# Altium schematic sheet SPI_Breakout.SchDoc
size A4; SheetNumber: 5; SheetTotal: 11
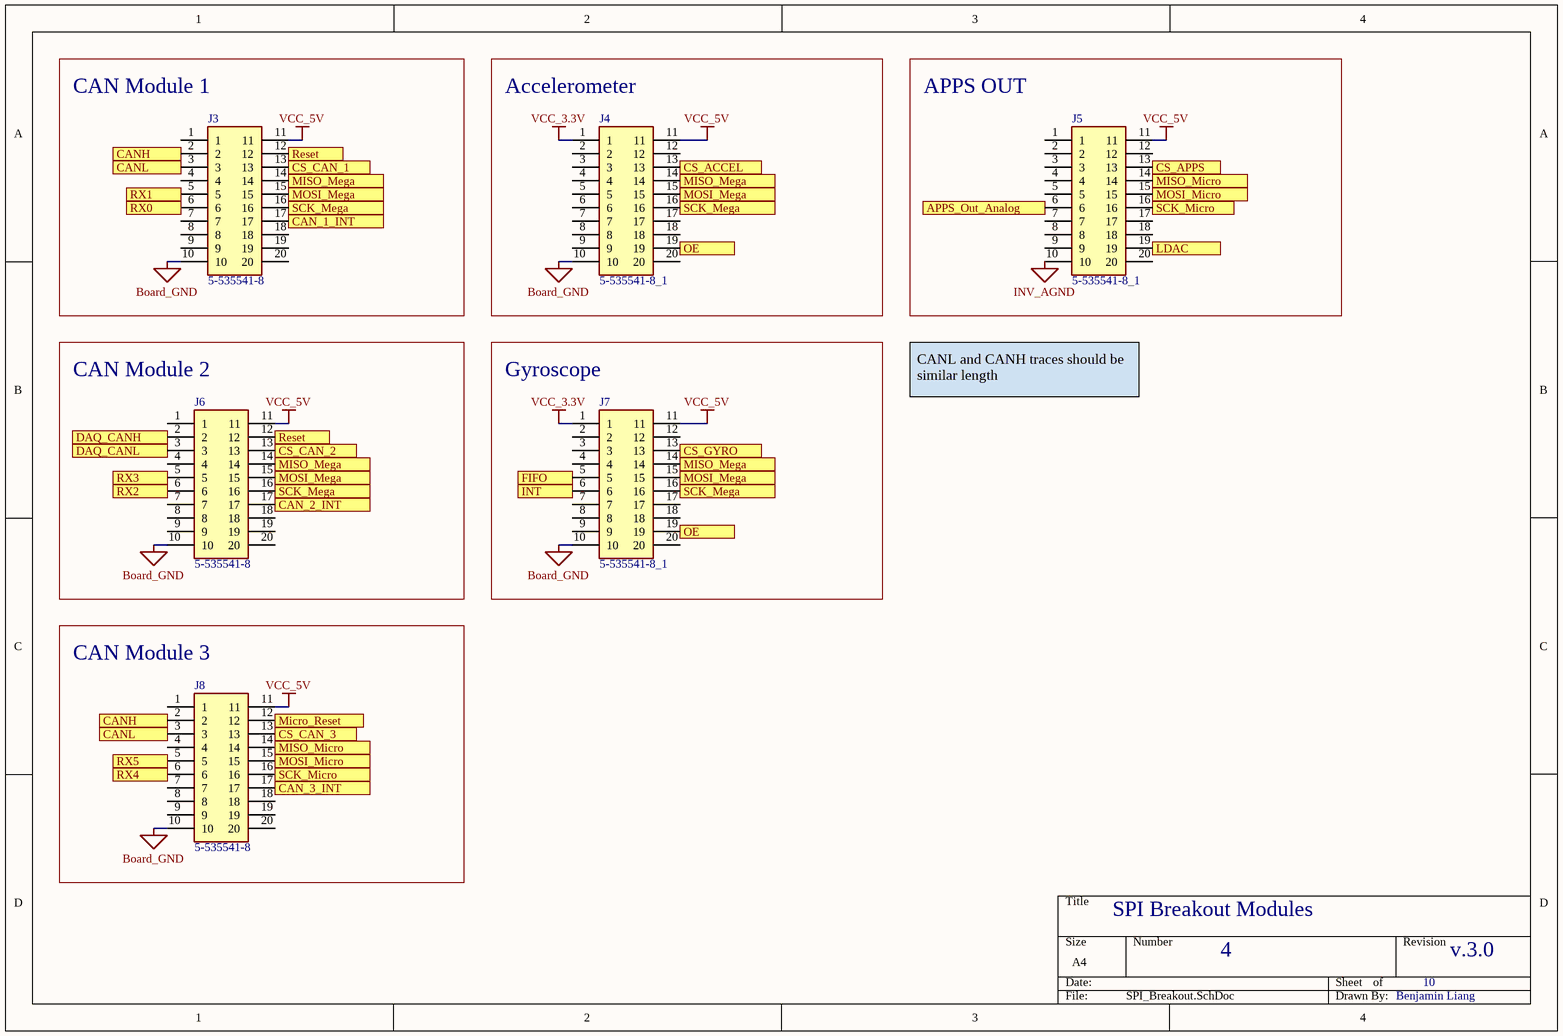
[diagram p0: SPI_Breakout.SchDoc]

## Parts
J3  5-535541-8  [RHDR10W76P0X254_1X10_2540X356X889P_1.3]
J4  5-535541-8_1  [RHDR10W76P0X254_1X10_2540X356X889P_0.6]
J5  5-535541-8_1  [RHDR10W76P0X254_1X10_2540X356X889P_0.6]
J6  5-535541-8  [RHDR10W76P0X254_1X10_2540X356X889P_1.3]
J7  5-535541-8_1  [RHDR10W76P0X254_1X10_2540X356X889P_0.6]
J8  5-535541-8  [RHDR10W76P0X254_1X10_2540X356X889P_1.3]

## Blocks framed on the sheet
CAN Module 1: J3
Accelerometer: J4
APPS OUT: J5
CAN Module 2: J6
Gyroscope: J7
CAN Module 3: J8

## Ports
APPS_Out_Analog, CAN_1_INT, CAN_2_INT, CAN_3_INT, CANH, CANL, CS_ACCEL, CS_APPS, CS_CAN_1, CS_CAN_2, CS_CAN_3, CS_GYRO, DAQ_CANH, DAQ_CANL, FIFO, INT, LDAC, Micro_Reset, MISO_Mega, MISO_Micro, MOSI_Mega, MOSI_Micro, OE, Reset, RX0, RX1, RX2, RX3, RX4, RX5, SCK_Mega, SCK_Micro

## Nets
Board_GND: J3.10 J4.10 J6.10 J7.10 J8.10
INV_AGND: J5.10
VCC_3.3V: J4.1 J7.1
VCC_5V: J3.11 J4.11 J5.11 J6.11 J7.11 J8.11
APPS_Out_Analog: J5.6 ; port APPS_Out_Analog
CAN_1_INT: J3.17 ; port CAN_1_INT
CAN_2_INT: J6.17 ; port CAN_2_INT
CAN_3_INT: J8.17 ; port CAN_3_INT
CANH: J3.2 J8.2 ; port CANH
CANL: J3.3 J8.3 ; port CANL
CS_ACCEL: J4.13 ; port CS_ACCEL
CS_APPS: J5.13 ; port CS_APPS
CS_CAN_1: J3.13 ; port CS_CAN_1
CS_CAN_2: J6.13 ; port CS_CAN_2
CS_CAN_3: J8.13 ; port CS_CAN_3
CS_GYRO: J7.13 ; port CS_GYRO
DAQ_CANH: J6.2 ; port DAQ_CANH
DAQ_CANL: J6.3 ; port DAQ_CANL
FIFO: J7.5 ; port FIFO
INT: J7.6 ; port INT
LDAC: J5.19 ; port LDAC
Micro_Reset: J8.12 ; port Micro_Reset
MISO_Mega: J3.14 J4.14 J6.14 J7.14 ; port MISO_Mega
MISO_Micro: J5.14 J8.14 ; port MISO_Micro
MOSI_Mega: J3.15 J4.15 J6.15 J7.15 ; port MOSI_Mega
MOSI_Micro: J5.15 J8.15 ; port MOSI_Micro
OE: J4.19 J7.19 ; port OE
Reset: J3.12 J6.12 ; port Reset
RX0: J3.6 ; port RX0
RX1: J3.5 ; port RX1
RX2: J6.6 ; port RX2
RX3: J6.5 ; port RX3
RX4: J8.6 ; port RX4
RX5: J8.5 ; port RX5
SCK_Mega: J3.16 J4.16 J6.16 J7.16 ; port SCK_Mega
SCK_Micro: J5.16 J8.16 ; port SCK_Micro

Not connected (* = marked no-connect by the designer): J3 1 4 7 8 9 18 19 20; J4 2 3 4 5 6 7 8 9 12 17 18 20; J5 1 2 3 4 5 7 8 9 12 17 18 20; J6 1 4 7 8 9 18 19 20; J7 2 3 4 7 8 9 12 17 18 20; J8 1 4 7 8 9 18 19 20

## Notes on the sheet
- CANL and CANH traces should be similar length
- SPI Breakout Modules
- 4
- 10
- v.3.0
- Benjamin Liang

## Library data of the parts
J3 J6 J8 = 5-535541-8: Connector; Manufacturer_Name: TE Connectivity; Datasheet Link: http://catalog.tycoelectronics.com/TE/bin/TE.Connect?C=1&PN=5-535541-8&M=BYPN&LG=1&I=13&button.x=43&button.y=16; Height: 8.89mm; Manufacturer_Part_Number: 5-535541-8; Mouser Part Number: 571-5-535541-8; Mouser Price/Stock: https://www.mouser.co.uk/ProductDetail/TE-Connectivity/5-535541-8?qs=xDp7PGUNC%252Bt0eA%2FEm7ovMw%3D%3D; Arrow Part Number: 5-535541-8; Arrow Price/Stock: https://www.arrow.com/en/products/5-535541-8/te-connectivity
J4 J5 J7 = 5-535541-8_1: Connector; Manufacturer_Name: TE Connectivity; Datasheet Link: http://catalog.tycoelectronics.com/TE/bin/TE.Connect?C=1&PN=5-535541-8&M=BYPN&LG=1&I=13&button.x=43&button.y=16; Height: 8.89mm; Manufacturer_Part_Number: 5-535541-8; Mouser Part Number: 571-5-535541-8; Mouser Price/Stock: https://www.mouser.co.uk/ProductDetail/TE-Connectivity/5-535541-8?qs=xDp7PGUNC%252Bt0eA%2FEm7ovMw%3D%3D; Arrow Part Number: 5-535541-8; Arrow Price/Stock: https://www.arrow.com/en/products/5-535541-8/te-connectivity